# Altium schematic sheet E17-04_DC_DC_CONTROL.SchDoc
size A
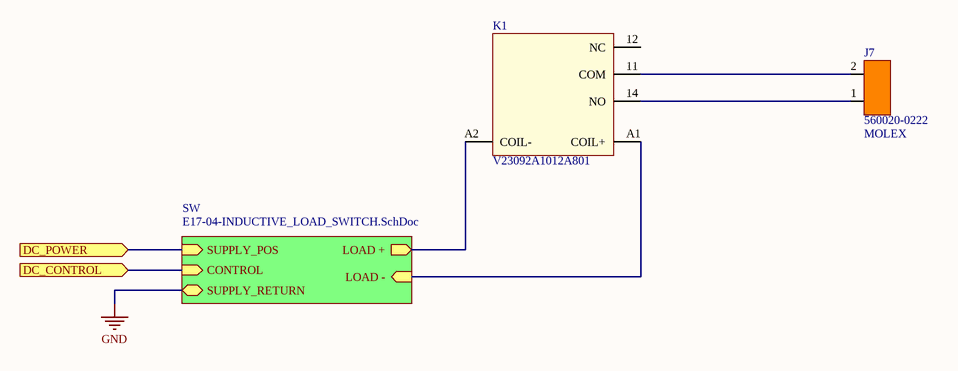
[diagram p0: E17-04_DC_DC_CONTROL.SchDoc]

## Parts
J7  MANUFACTURER: MOLEX  [MOLEX_DURACLIK_2 RED VERT]  (hidden comment: DC TO DC)
K1  V23092A1012A801  [SCHRACK]

## Sub-sheets
SW = E17-04-INDUCTIVE_LOAD_SWITCH.SchDoc: CONTROL (in), LOAD + (out), SUPPLY_POS (in), LOAD - (in), SUPPLY_RETURN

## Ports
DC_CONTROL (in), DC_POWER (in)

## Nets
GND: sheet SW/SUPPLY_RETURN
DC_CONTROL: port DC_CONTROL, sheet SW/CONTROL
DC_POWER: port DC_POWER, sheet SW/SUPPLY_POS
NetJ7_1: J7.1 K1.14(NO)
NetJ7_2: J7.2 K1.11(COM)
NetK1_A1: K1.A1(COIL+) ; sheet SW/LOAD -
NetK1_A2: K1.A2(COIL-) ; sheet SW/LOAD +

Not connected (* = marked no-connect by the designer): K1 12(NC)

## Library data of the parts
J7 = 560020-0222: MOLEX DURACLIK 2-PIN VERT RED; POSITIONS: 2; PLATING: Tin (Sn); CURRENT: 3; VOLTAGE: 125; UL: 94V-0; Digikey_PN: Not in production; COLOR: RED; SERIES: Duraclik; ORIENTATOIN: VERT; MPN: 560020-0222
K1 = V23092A1012A801: 12V slim SPDT Relay; MFG: TE; DC Contact Voltage: 300; Coil Voltage: 12; Coil Current: 0.0142; DIGIKEY_PN: PB2044-ND; Supplier 1: Digikey; Supplier Part Number 1: PB2044-ND; MFG_PN: V23092A1012A801